# Altium schematic sheet ZYNQ-JTAG.SchDoc
size A3; SheetNumber: 6; SheetTotal: 9
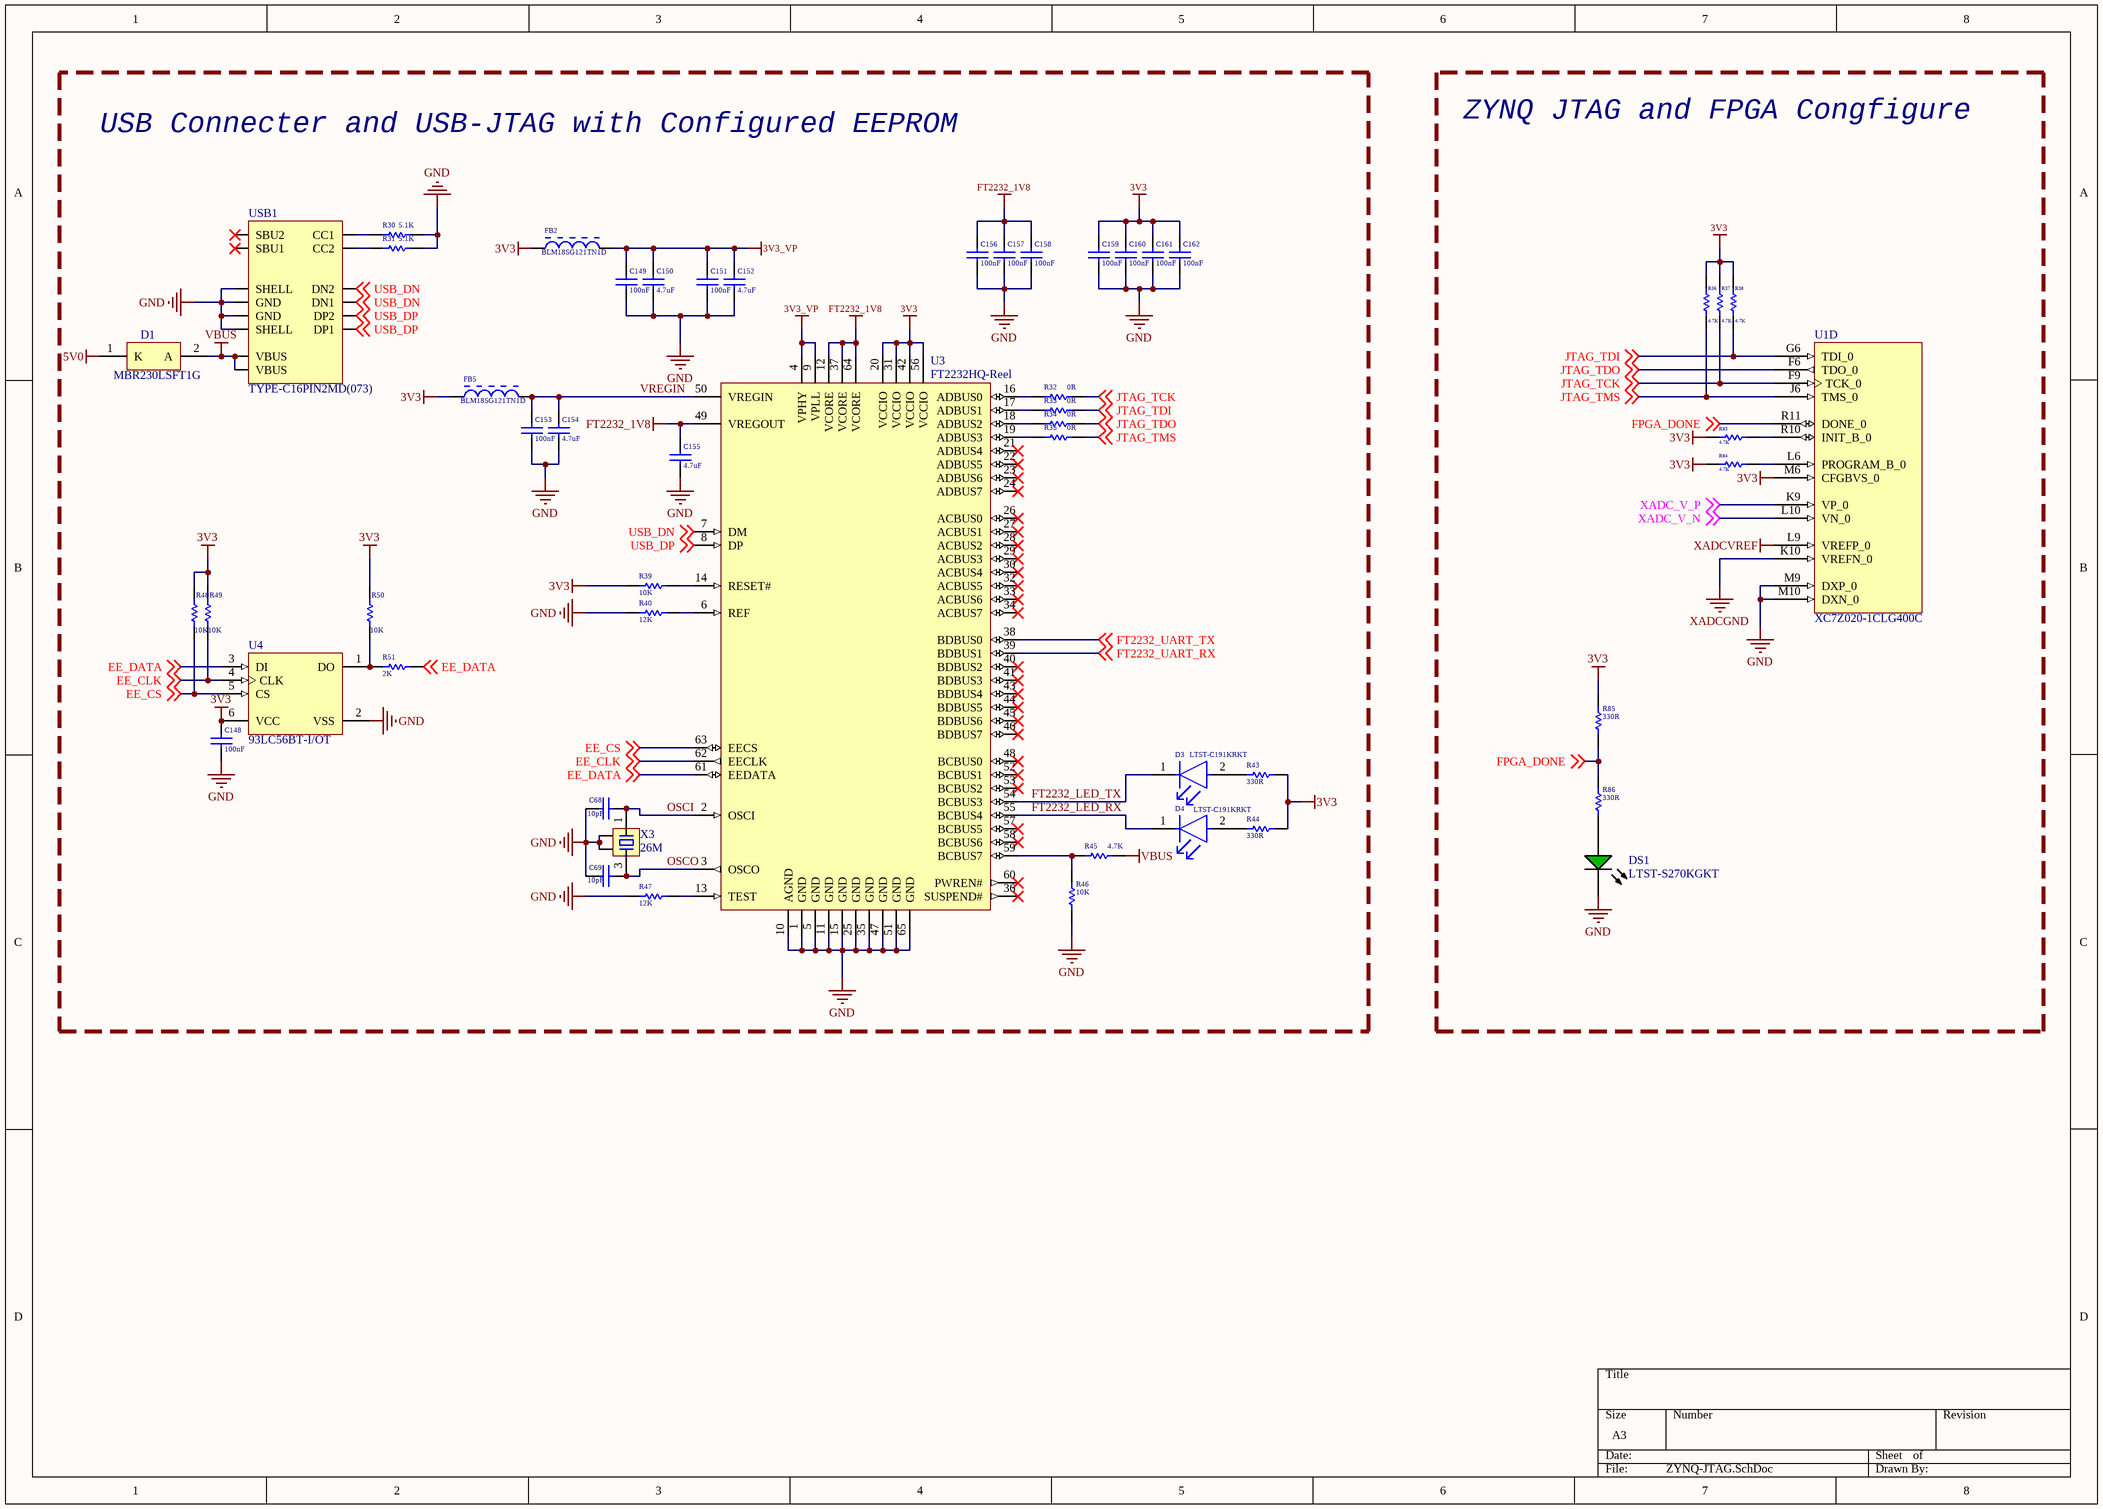
[diagram p0: ZYNQ-JTAG.SchDoc]

## Parts
C68  10pF  [CAPC1005X55X25LL05T10]
C69  10pF  [CAPC1005X55X25LL05T10]
C148  100nF  [CAPC1005X55X25LL05T10]
C149  100nF  [CAPC1005X55X25LL05T10]
C150  4.7uF  [CAPC1005X55X25LL05T10]
C151  100nF  [CAPC1005X55X25LL05T10]
C152  4.7uF  [CAPC1005X55X25LL05T10]
C153  100nF  [CAPC1005X55X25LL05T10]
C154  4.7uF  [CAPC1005X55X25LL05T10]
C155  4.7uF  [CAPC1005X55X25LL05T10]
C156  100nF  [CAPC1005X55X25LL05T10]
C157  100nF  [CAPC1005X55X25LL05T10]
C158  100nF  [CAPC1005X55X25LL05T10]
C159  100nF  [CAPC1005X55X25LL05T10]
C160  100nF  [CAPC1005X55X25LL05T10]
C161  100nF  [CAPC1005X55X25LL05T10]
C162  100nF  [CAPC1005X55X25LL05T10]
D1  MBR230LSFT1G  [ONSC-SOD-123FL-2-498-01_V]
D3  LTST-C191KRKT  [FP-LTST-C191KRKT-MFG]
D4  LTST-C191KRKT  [FP-LTST-C191KRKT-MFG]
DS1  LTST-S270KGKT  [LTST-LTST-S270KGKT-2_V]
FB2  BLM18SG121TN1D  [MURA-BLM18SG-B40-CHIP-2_V6]
FB5  BLM18SG121TN1D  [MURA-BLM18SG-B40-CHIP-2_V6]
R30  5.1K  [RESC1005X40X25LL05T05]
R31  5.1K  [RESC1005X40X25LL05T05]
R32  0R  [RESC1005X40X25LL05T05]
R33  0R  [RESC1005X40X25LL05T05]
R34  0R  [RESC1005X40X25LL05T05]
R35  0R  [RESC1005X40X25LL05T05]
R36  4.7K  [RESC1005X40X25LL05T05]
R37  4.7K  [RESC1005X40X25LL05T05]
R38  4.7K  [RESC1005X40X25LL05T05]
R39  10K  [RESC1005X40X25LL05T05]
R40  12K  [RESC1005X40X25LL05T05]
R43  330R  [RESC1005X40X25LL05T05]
R44  330R  [RESC1005X40X25LL05T05]
R45  4.7K  [RESC1005X40X25LL05T05]
R46  10K  [RESC1005X40X25LL05T05]
R47  12K  [RESC1005X40X25LL05T05]
R48  10K  [RESC1005X40X25LL05T05]
R49  10K  [RESC1005X40X25LL05T05]
R50  10K  [RESC1005X40X25LL05T05]
R51  2K  [RESC1005X40X25LL05T05]
R83  4.7K  [RESC1005X40X25LL05T05]
R84  4.7K  [RESC1005X40X25LL05T05]
R85  330R  [RESC1005X40X25LL05T05]
R86  330R  [RESC1005X40X25LL05T05]
U1  XC7Z020-1CLG400C  [CLG400]  (part D of 9)
U3  FT2232HQ-Reel  [QFN64_2_L]
U4  93LC56BT-I/OT  [SOT-23-OT6_N]
USB1  TYPE-C16PIN2MD(073)  [TYPE-C16PIN2MD(073)-Footprint]
X3  26M  [XTAL-3225-4P]

## Blocks framed on the sheet
USB Connecter and USB-JTAG with Configured EEPROM: C68 C69 C148-C162 D1 D3 D4 FB2 FB5 R30-R35 R39 R40 R43-R51 U3 U4 USB1 X3
ZYNQ JTAG and FPGA Congfigure: DS1 R36-R38 R83-R86 U1

## Nets
3V3: C148.1 C159.1 C160.1 C161.1 C162.1 FB2.1 FB5.1 R36.1 R37.1 R38.1 R39.2 R43.1 R44.1 R48.2 R49.2 R50.2 R83.1 R84.1 R85.2 U1.M6(CFGBVS_0) U3.20(VCCIO) U3.31(VCCIO) U3.42(VCCIO) U3.56(VCCIO) U4.6(VCC)
3V3_VP: C149.1 C150.1 C151.1 C152.1 FB2.2 U3.4(VPHY) U3.9(VPLL)
5V0: D1.1(K)
FT2232_1V8: C155.1 C156.1 C157.1 C158.1 U3.12(VCORE) U3.37(VCORE) U3.49(VREGOUT) U3.64(VCORE)
GND: C68.2 C69.2 C148.2 C149.2 C150.2 C151.2 C152.2 C153.2 C154.2 C155.2 C156.2 C157.2 C158.2 C159.2 C160.2 C161.2 C162.2 DS1.1(K) R30.1 R31.1 R40.1 R46.1 R47.1 U1.M9(DXP_0) U1.M10(DXN_0) U3.1(GND) U3.5(GND) U3.10(AGND) U3.11(GND) U3.15(GND) U3.25(GND) U3.35(GND) U3.47(GND) U3.51(GND) U3.65(GND) U4.2(VSS) USB1.1(GND) USB1.12(GND) USB1.13(SHELL) USB1.14(SHELL) X3.2 X3.4
VBUS: D1.2(A) R45.2 USB1.2(VBUS) USB1.11(VBUS)
XADCGND: U1.K10(VREFN_0)
XADCVREF: U1.L9(VREFP_0)
EE_CLK: R49.1 U3.62(EECLK) U4.4(CLK) ; off-sheet EE_CLK
EE_CS: R48.1 U3.63(EECS) U4.5(CS) ; off-sheet EE_CS
EE_DATA: R51.1 U3.61(EEDATA) U4.3(DI) ; off-sheet EE_DATA
FPGA_DONE: R85.1 R86.2 U1.R11(DONE_0) ; off-sheet FPGA_DONE
FT2232_LED_RX: D4.1(C) U3.55(BCBUS4)
FT2232_LED_TX: D3.1(C) U3.54(BCBUS3)
FT2232_UART_RX: U3.39(BDBUS1) ; off-sheet FT2232_UART_RX
FT2232_UART_TX: U3.38(BDBUS0) ; off-sheet FT2232_UART_TX
JTAG_TCK: R32.2 R37.2 U1.F9(TCK_0) ; off-sheet JTAG_TCK
JTAG_TDI: R33.2 R38.2 U1.G6(TDI_0) ; off-sheet JTAG_TDI
JTAG_TDO: R34.2 U1.F6(TDO_0) ; off-sheet JTAG_TDO
JTAG_TMS: R35.2 R36.2 U1.J6(TMS_0) ; off-sheet JTAG_TMS
OSCI: C68.1 U3.2(OSCI) X3.1
OSCO: C69.1 U3.3(OSCO) X3.3
USB_DN: U3.7(DM) USB1.5(DN2) USB1.7(DN1) ; off-sheet USB_DN
USB_DP: U3.8(DP) USB1.6(DP1) USB1.8(DP2) ; off-sheet USB_DP
VREGIN: C153.1 C154.1 FB5.2 U3.50(VREGIN)
XADC_V_N: U1.L10(VN_0) ; off-sheet XADC_V_N
XADC_V_P: U1.K9(VP_0) ; off-sheet XADC_V_P
NetD3_2: D3.2(A) R43.2
NetD4_2: D4.2(A) R44.2
NetDS1_2: DS1.2(A) R86.1
NetR30_2: R30.2 USB1.4(CC1)
NetR31_2: R31.2 USB1.10(CC2)
NetR32_1: R32.1 U3.16(ADBUS0)
NetR33_1: R33.1 U3.17(ADBUS1)
NetR34_1: R34.1 U3.18(ADBUS2)
NetR35_1: R35.1 U3.19(ADBUS3)
NetR39_1: R39.1 U3.14(RESET#)
NetR40_2: R40.2 U3.6(REF)
NetR45_1: R45.1 R46.2 U3.59(BCBUS7)
NetR47_2: R47.2 U3.13(TEST)
NetR50_1: R50.1 R51.2 U4.1(DO)
NetR83_2: R83.2 U1.R10(INIT_B_0)
NetR84_2: R84.2 U1.L6(PROGRAM_B_0)

Not connected (* = marked no-connect by the designer): U3 21(ADBUS4)* 22(ADBUS5)* 23(ADBUS6)* 24(ADBUS7)* 26(ACBUS0)* 27(ACBUS1)* 28(ACBUS2)* 29(ACBUS3)* 30(ACBUS4)* 32(ACBUS5)* 33(ACBUS6)* 34(ACBUS7)* 36(SUSPEND#)* 40(BDBUS2)* 41(BDBUS3)* 43(BDBUS4)* 44(BDBUS5)* 45(BDBUS6)* 46(BDBUS7)* 48(BCBUS0)* 52(BCBUS1)* 53(BCBUS2)* 57(BCBUS5)* 58(BCBUS6)* 60(PWREN#)*; USB1 3(SBU2)* 9(SBU1)*

## Library data of the parts
C68 C69 C148-C162 = CMP-2008-04639-1: Part Number: GRM155R71H104KE14D; Manufacturer: Murata
D1 = CMP-1055-00442-1: Schottky Power Rectifier, 2-Pin SOD-123, Pb-Free, Tape and Reel; Manufacturer: On Semiconductor; Configuration: Single; IFSM Max (A): 40; ComponentLink2Description: Datasheet; DatasheetVersion: Rev. 0; ComponentLink1URL: http://www.onsemi.com/; ComponentLink2URL: http://www.onsemi.cn/pub_link/Collateral/MBR230LSFT1G.PDF; ComponentLink3Description: Package Specification; PackageDescription: 2-Pin SOD, Body 1.65 x 2.7 mm; RoHS: TRUE; PackageVersion: Rev. A; Mounting Technology: Surface Mount; ComponentLink3URL: http://www.onsemi.cn/pub_link/Collateral/MBR120VLSFT1-D.PDF; ComponentLink1Description: Manufacturer URL; Packing: Tape and Reel; PackageReference: SOD-123FL-2-498-01; PartNumber: MBR230LSFT1G
D3 D4 = CMP-2000-05199-2
DS1 = CMP-2000-06629-1: Ultra Bright AlInGaP Chip LED, 75 mW, -30 to 85 degC, 2-Pin SMD (0604), RoHS, Tape and Reel; Manufacturer: Lite-On; Luminous Intensity: 71mcd; Reverse Voltage: 5V; Power Dissipation: 75W; Viewing Angle: 130deg; Shape Type: Rectangular; DELETED: Compliant; Type: Uni-Color; Peak Wavelength: 574nm; Forward Current Max: 30mA; Emitting Color: YellowGreen; Number of  Elements: 1; Forward Voltage: 2.4V; Product Depth (mm): 0.6mm; Power Dissipation Max: 75mW; Dominant Wave Length: 571nm; Product Length (mm): 1.6mm; Chip Material: AlGaInP; Product Height (mm): 1.15mm; Rad Hardened: No; High Brightness: Yes; Test Current (It): 20mA; Main Category: ChipLED; Mounting: SurfaceMount; Operating Temperature Classification: Industrial; Mounting Technology: SurfaceMount; Packaging: TapeandReel; Datasheet URL: http://optoelectronics.liteon.com/upload/download/DS22-2000-226/S_110_LTST-S270KGKT.pdf; Package Type: ChipLed; Datasheet Version: Rev. I, 04/2012; Forward Current: 30mA; Operating Temp Range: -55Cto85C; Lens Dimensions: 1.2X0.6X0.47mm; Pin Count: 2; Manufacturer URL: http://www.us.liteon.com/; Lum Intensity: 71mcd; Package Reference: LTST-S270KGKT-2; Package Description: 2-Pin Surface Mounted Device, Body 1.65 x 0.6 mm
FB2 FB5 = CMP-0686-00602-3: Chip Ferrite Bead for Power Lines (Low DC Resistance Type), 120 Ohm, 3000 mA, -55 to 125 degC, 1.6 x 0.8 x 0.65 mm SMD, Tape and Reel; Manufacturer: Murata; Impedance (at 100 MHz): 120 Ohm +/- 25%; Rated Current: 3000 mA; DC Resistance: 0.025 Ohm Max.; ComponentLink3Description: Package Specification; PackageReference: BLM18_H650-2; DatasheetVersion: 08/2013; Packing: Tape and Reel; PartNumber: BLM18SG121TN1D; PackageDescription: 2-Pin Chip, Body 1.6 x 0.8 mm; ComponentLink2Description: Datasheet; ComponentLink3URL: http://www.murata.com/products/catalog/pdf/c31e.pdf; ComponentLink1URL: http://www.murata.com/; Operating Temperature Range: -55 to 125 degC; Mounting Technology: Surface Mount; ComponentLink2URL: http://www.murata.com/products/catalog/pdf/c31e.pdf; ComponentLink1Description: Manufacturer URL
R30-R40 R43-R51 R83-R86 = CMP-2002-00921-1: Manufacturer: Panasonic; Part Number: ERJ-2RKF40R2X
U1 = CMP-0363-00002-3: 667 MHz Zynq™-7000 AP SoC, 130 PS I/O, 125 FPGA I/O, 400-Ball BGA, Speed Grade 1, Commercial Grade, Pb-Free; Flip Flops: 106400; Speed Grade: -1; LUTs: 53200; Extensible Block RAM (# 36Kb Blocks): 560 KB (140); PackageVersion: Rev 1.1, 09/2012; ComponentLink1Description: Datasheet; ComponentLink2Description: Package Specification; ComponentLink6Description: PCB and Layout Guide; PackageDescription: Wire-Bond Chip-Scale BGA, Body 17 x 17 mm, 0.8 mm Pitch; RoHS: Pb-Free; DatasheetVersion: v1.2; Mounting Technology: Surface Mount; ComponentLink5Description: Packaging and Pinout; ComponentLink5URL: http://www.xilinx.com/support/documentation/user_guides/ug865-Zynq-7000-Pkg-Pinout.pdf; ComponentLink6URL: http://www.xilinx.com/support/documentation/user_guides/ug483_7Series_PCB.pdf; Generic Part Number: XC7Z020; ComponentLink3Description: DC and AC Switching Characteristics; ComponentLink2URL: http://www.xilinx.com/support/documentation/user_guides/ug865-Zynq-7000-Pkg-Pinout.pdf; ComponentLink4Description: Package File; ComponentLink1URL: http://www.xilinx.com/support/documentation/data_sheets/ds190-Zynq-7000-Overview.pdf; PackageReference: CLG400; ComponentLink3URL: http://www.xilinx.com/support/documentation/data_sheets/ds187-XC7Z010-XC7Z020-Data-Sheet.pdf; PartNumber: XC7Z020-1CLG400C; ComponentLink4URL: http://www.xilinx.com/support/packagefiles/z7packages/xc7z020clg400pkg.txt; Code_JEDEC: MO-275-MMAA-1
U3 = CMP-0078-00004-3: Dual High Speed USB To Multipurpose UART/FIFO IC, 64-pin QFN, Tape and Reel; Manufacturer: FTDI; ComponentLink2Description: Datasheet; RevisionNote: DatasheetVersion updated to 2.21 Jun-2012; ComponentLink2URL: http://www.ftdichip.com/Support/Documents/DataSheets/ICs/DS_FT2232H.pdf; PackageReference: QFN64_2; ComponentLink1Description: Manufacturer URL; PackageDescription: 64-Pin Quad Flat No-Lead, 9 x 9 mm Body, 0.5 mm Pitch, 4.35 x 4.35 mm Exposed Pad; PackageVersion: Jun-12; DatasheetVersion: ver 2.21, Jun-2012; PartNumber: FT2232HQ-Reel; ComponentLink1URL: http://www.ftdichip.com/
U4 = CMP-0162-00356-1: 2K, 128x16-bit, 2.5V Microwire Serial EEPROM, 6-Pin SOT-23, Industrial Temperature, Tape and Reel; DatasheetVersion: revF, May-2008; Code_IPC: SOT26A-6; PackageReference: SOT-23-OT6; PackageVersion: revBB, Aug-2009; PackageDescription: 6-Lead Plastic Small Outline Transistor (OT) [SOT-23]
USB1 = CMP-00018-3: Type-C 母 卧贴 带定位柱 不锈钢外壳 2次模顶; 商品目录: USB连接器; 触点数量: 16P; 额定电流 - 电源: 5A; 端口数量: 1; 工作温度范围: -25℃~+85℃; 公母: 母; 安装方式: 卧贴; 连接器类型: Type-C; 标准: -
X3 = XTAL-4P: 4脚无源晶振(谐振器）; 联系下单店铺卖家 免费帮你查找封装: 联系下单店铺卖家 免费技术支持; BOM名称: 4脚无源晶振(谐振器）